# EAGLE schematic shield_motor (EAGLE 8.3.0)
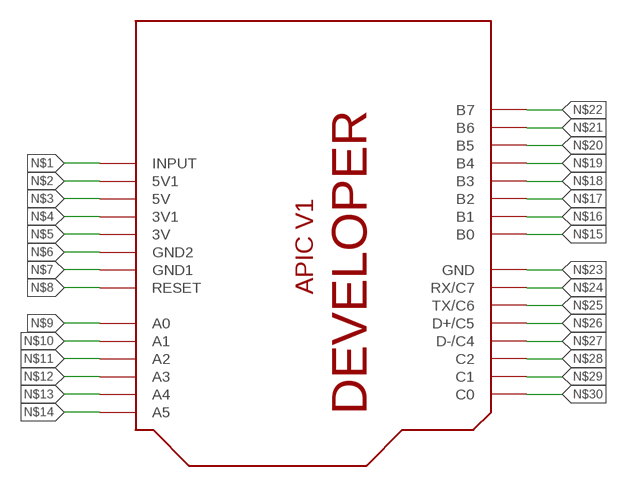
[diagram p0: schematic, sheet 1]

## Parts
U1  APIC-BPLACE  [APIC]

## Nets
N$1: U1.INPUT
N$2: U1.5V1
N$3: U1.5V
N$4: U1.3V1
N$5: U1.3V
N$6: U1.GND2
N$7: U1.GND1
N$8: U1.RESET
N$9: U1.A0
N$10: U1.A1
N$11: U1.A2
N$12: U1.A3
N$13: U1.A4
N$14: U1.A5
N$15: U1.B0
N$16: U1.B1
N$17: U1.B2
N$18: U1.B3
N$19: U1.B4
N$20: U1.B5
N$21: U1.B6
N$22: U1.B7
N$23: U1.GND
N$24: U1.C7(RX/C7)
N$25: U1.C6(TX/C6)
N$26: U1.C5(D+/C5)
N$27: U1.C4(D-/C4)
N$28: U1.C2
N$29: U1.C1
N$30: U1.C0

## Library data of the parts
U1 = 1AugustoLib:APIC: This is a new object for the new Arduino R3 - with extra pins that you may want to use (such as IOref, and duplicated A4/A5